# EAGLE design lp_breadboard_mini (EAGLE 7.2.0)
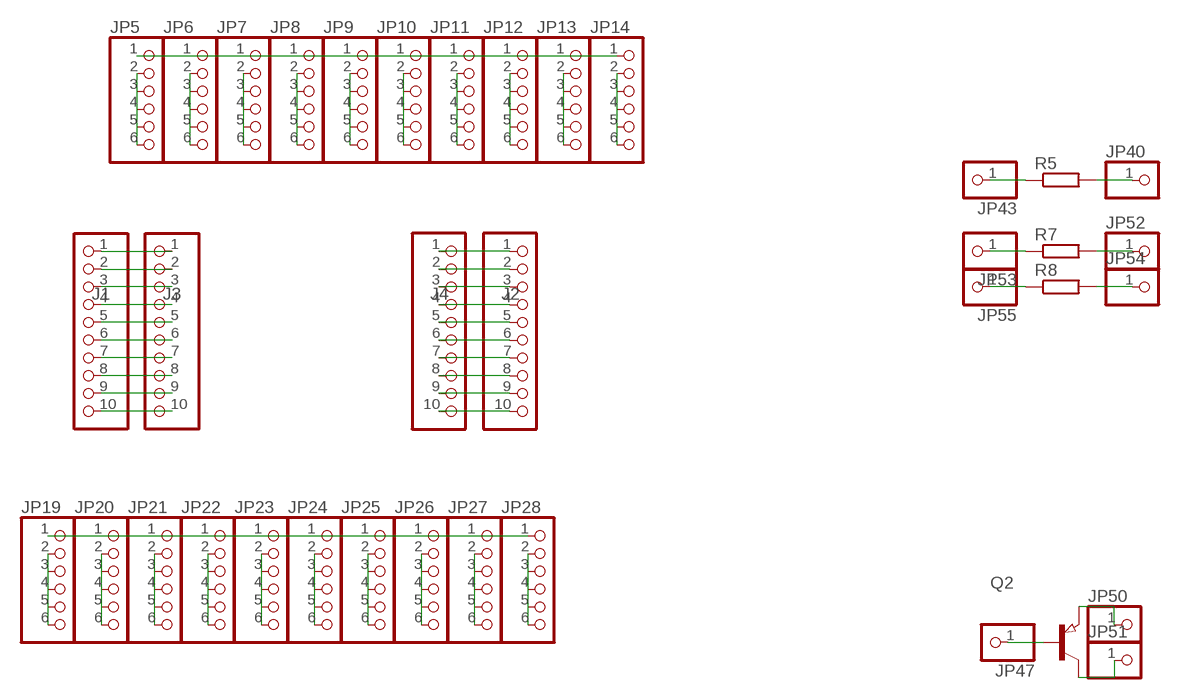
[diagram p0: schematic, sheet 1]

## Parts
J1  PINHD-1X10  [1X10]
J2  PINHD-1X10  [1X10]
J3  PINHD-1X10  [1X10]
J4  PINHD-1X10  [1X10]
JP5  PINHD-1X6  [1X06]
JP6  PINHD-1X6  [1X06]
JP7  PINHD-1X6  [1X06]
JP8  PINHD-1X6  [1X06]
JP9  PINHD-1X6  [1X06]
JP10  PINHD-1X6  [1X06]
JP11  PINHD-1X6  [1X06]
JP12  PINHD-1X6  [1X06]
JP13  PINHD-1X6  [1X06]
JP14  PINHD-1X6  [1X06]
JP19  PINHD-1X6  [1X06]
JP20  PINHD-1X6  [1X06]
JP21  PINHD-1X6  [1X06]
JP22  PINHD-1X6  [1X06]
JP23  PINHD-1X6  [1X06]
JP24  PINHD-1X6  [1X06]
JP25  PINHD-1X6  [1X06]
JP26  PINHD-1X6  [1X06]
JP27  PINHD-1X6  [1X06]
JP28  PINHD-1X6  [1X06]
JP40  PINHD-1X1  [1X01]
JP43  PINHD-1X1  [1X01]
JP47  PINHD-1X1  [1X01]
JP50  PINHD-1X1  [1X01]
JP51  PINHD-1X1  [1X01]
JP52  PINHD-1X1  [1X01]
JP53  PINHD-1X1  [1X01]
JP54  PINHD-1X1  [1X01]
JP55  PINHD-1X1  [1X01]
Q2  PNP-TRANSISTOR_SOT23  [SOT23]
R5  R-EU_R0805  [R0805]
R7  R-EU_R0805  [R0805]
R8  R-EU_R0805  [R0805]

## Nets
GND [GND]: J2.1 J4.1 JP5.1 JP6.1 JP7.1 JP8.1 JP9.1 JP10.1 JP11.1 JP12.1 JP13.1 JP14.1
N$2: J1.2 J3.2
N$3: JP6.2 JP6.3 JP6.4 JP6.5 JP6.6
N$5: JP24.2 JP24.3 JP24.4 JP24.5 JP24.6
N$10: JP19.2 JP19.3 JP19.4 JP19.5 JP19.6
N$11: JP20.2 JP20.3 JP20.4 JP20.5 JP20.6
N$12: JP7.2 JP7.3 JP7.4 JP7.5 JP7.6
N$13: JP22.2 JP22.3 JP22.4 JP22.5 JP22.6
N$14: JP21.2 JP21.3 JP21.4 JP21.5 JP21.6
N$15: J2.2 J4.2
N$16: J2.10 J4.10
N$17: JP8.2 JP8.3 JP8.4 JP8.5 JP8.6
N$18: JP9.2 JP9.3 JP9.4 JP9.5 JP9.6
N$19: JP10.2 JP10.3 JP10.4 JP10.5 JP10.6
N$21: J1.10 J3.10
N$22: JP11.2 JP11.3 JP11.4 JP11.5 JP11.6
N$24: JP23.2 JP23.3 JP23.4 JP23.5 JP23.6
N$25: J2.3 J4.3
N$26: J2.4 J4.4
N$27: J1.3 J3.3
N$28: JP12.2 JP12.3 JP12.4 JP12.5 JP12.6
N$29: JP13.2 JP13.3 JP13.4 JP13.5 JP13.6
N$30: J1.4 J3.4
N$31: J1.5 J3.5
N$32: JP14.2 JP14.3 JP14.4 JP14.5 JP14.6
N$35: J1.6 J3.6
N$36: J2.5 J4.5
N$37: J2.6 J4.6
N$39: JP5.2 JP5.3 JP5.4 JP5.5 JP5.6
N$40: J1.7 J3.7
N$41: J2.7 J4.7
N$42: JP25.2 JP25.3 JP25.4 JP25.5 JP25.6
N$43: J1.8 J3.8
N$44: J1.9 J3.9
N$45: J2.8 J4.8
N$46: JP26.2 JP26.3 JP26.4 JP26.5 JP26.6
N$47: J2.9 J4.9
N$48: JP27.2 JP27.3 JP27.4 JP27.5 JP27.6
N$49: JP28.2 JP28.3 JP28.4 JP28.5 JP28.6
N$63: JP43.1 R5.1
N$66: JP40.1 R5.2
N$70: JP47.1 Q2.1(B)
N$73: JP50.1 Q2.2(E)
N$74: JP51.1 Q2.3(C)
N$75: JP53.1 R7.1
N$76: JP52.1 R7.2
N$77: JP55.1 R8.1
N$78: JP54.1 R8.2
VCC [VCC]: J1.1 J3.1 JP19.1 JP20.1 JP21.1 JP22.1 JP23.1 JP24.1 JP25.1 JP26.1 JP27.1 JP28.1

## Library data of the parts
J1-J4 = pinhead:PINHD-1X10: PIN HEADER
JP5-JP14 JP19-JP28 = pinhead:PINHD-1X6: PIN HEADER
JP40 JP43 JP47 JP50-JP55 = pinhead:PINHD-1X1: PIN HEADER
Q2 = semicon-smd-ipc:PNP-TRANSISTOR_: PNP TRANSISTOR
R5 R7 R8 = resistor:R-EU_: RESISTOR, European symbol

## Net classes
0 default: width 0.508 mm, drill 0.508 mm
1 GND: width 0.813 mm, drill 0.508 mm
2 VCC: width 0.813 mm, drill 0.508 mm

## Board
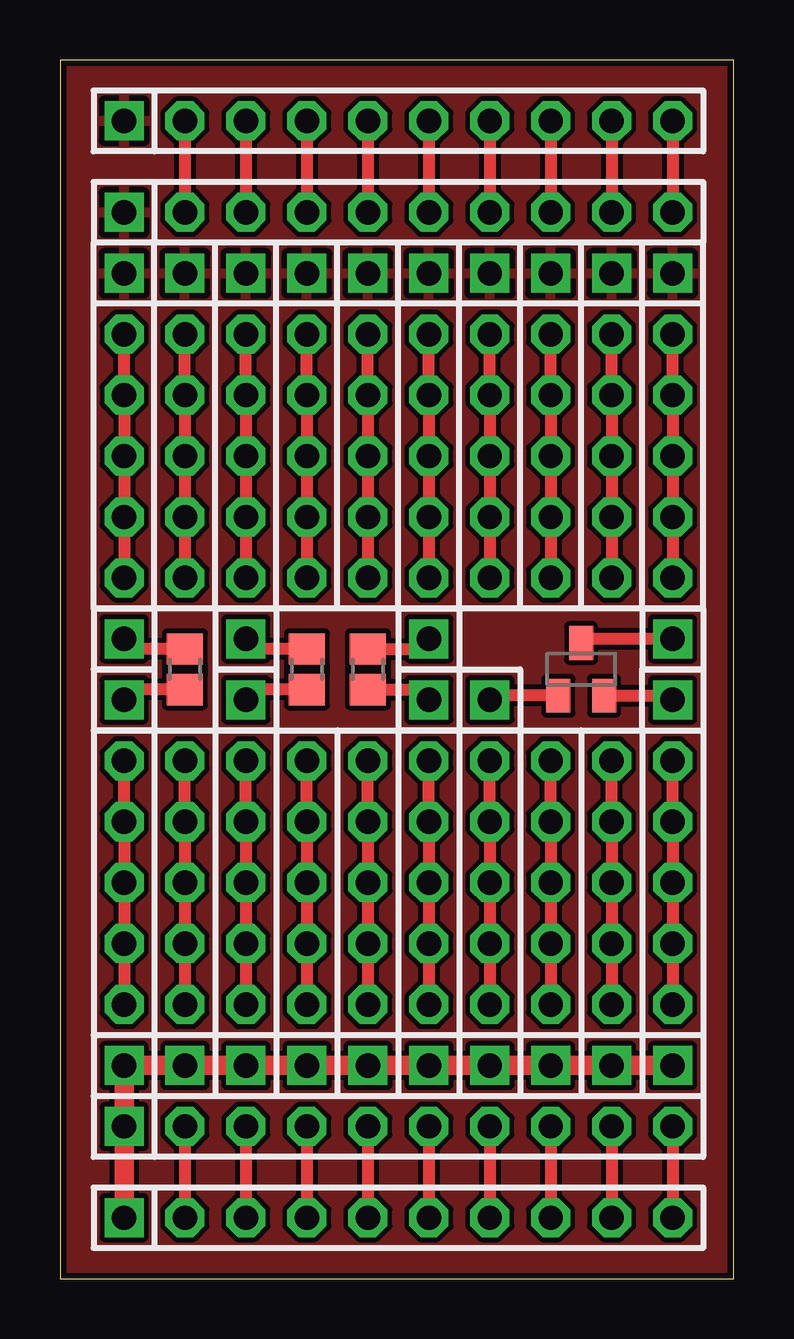
[diagram p1: board, top side]
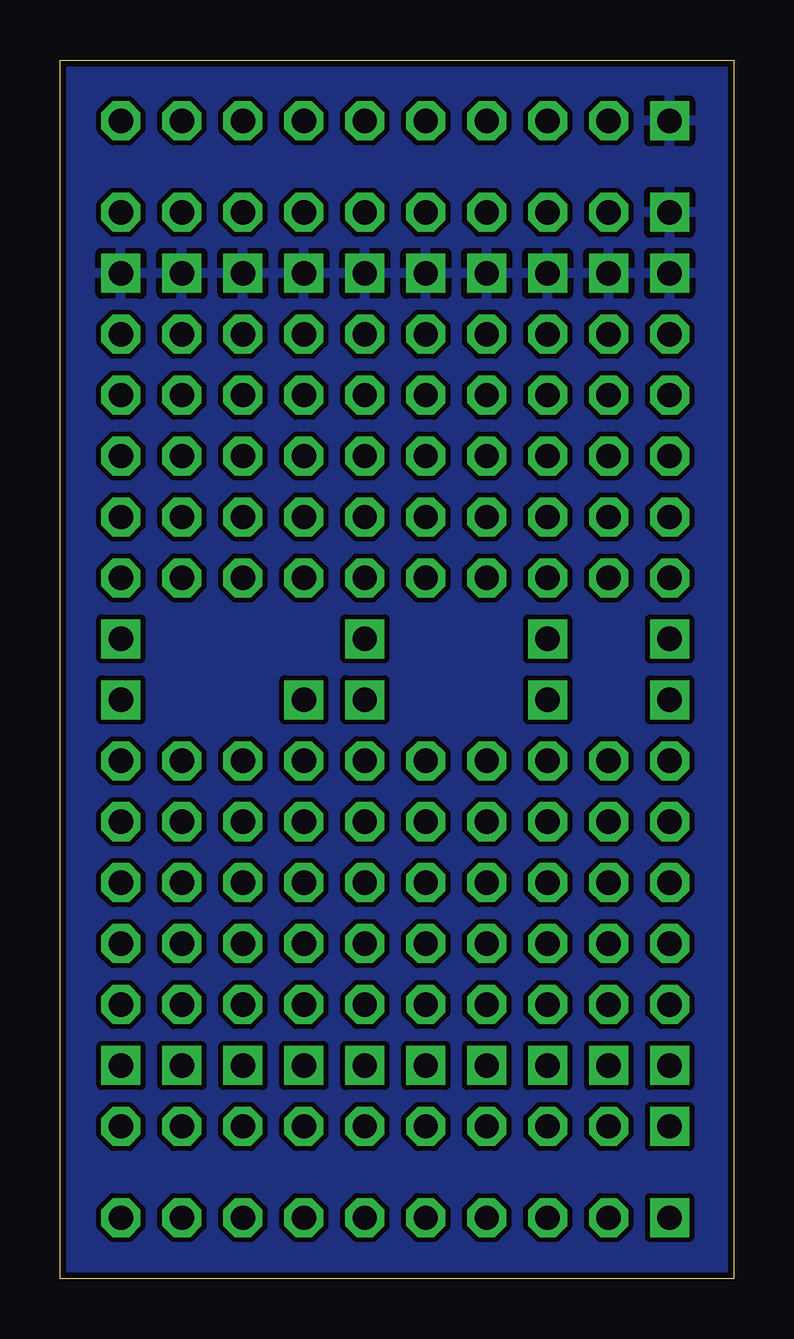
[diagram p2: board, bottom side, seen from below]

Size 28.07 x 50.8 mm. Coordinates in mm from the lower left corner, seen from the top.
Outline: 0,0 28.07,0 28.07,50.8 0,50.8 0,0
Copper layers (1*16): Top 0.035mm / dielectric 1.5mm / Bottom 0.035mm
Design rules "SparkFun *": minimum track width 20mil, minimum drill 20mil, track to track 8mil, track to pad 8mil, pad to pad 8mil, via to via 8mil, smd to smd 8mil, copper to edge 10mil, drill to drill 8mil, minimum pad ring 12mil, minimum via ring 10mil, stop-mask expansion 4mil, vias tented up to drill 25mil, thermal gap 10mil

### Footprints (pad centres in the part's own frame; a part is rotated, then mirrored left to right if it is on the bottom)
1X10 = drill 1.016 square: 1 -11.43,0 | drill 1.016 octagon: 2 -8.89,0; 3 -6.35,0; 4 -3.81,0; 5 -1.27,0; 6 1.27,0; 7 3.81,0; 8 6.35,0; 9 8.89,0; 10 11.43,0
1X06 = drill 1.016 square: 1 -6.35,0 | drill 1.016 octagon: 2 -3.81,0; 3 -1.27,0; 4 1.27,0; 5 3.81,0; 6 6.35,0
1X01 = drill 1.016 square: 1 0,0
SOT23 = smd 1 x 1.4: 1 -0.95,-1.1; 2 0.95,-1.1; 3 0,1.1
R0805 = smd 1.3 x 1.5: 1 -0.85,0; 2 0.85,0

### Placement (x,y rotation side)
J1  14.1,2.54 0 top
J2  14.1,48.26 0 top
J3  14.1,6.35 0 top
J4  14.1,44.45 0 top
JP5  2.67,35.56 270 top
JP6  5.21,35.56 270 top
JP7  7.75,35.56 270 top
JP8  10.29,35.56 270 top
JP9  12.83,35.56 270 top
JP10  15.37,35.56 270 top
JP11  17.91,35.56 270 top
JP12  20.45,35.56 270 top
JP13  22.99,35.56 270 top
JP14  25.53,35.56 270 top
JP19  25.53,15.24 90 top
JP20  22.99,15.24 90 top
JP21  20.45,15.24 90 top
JP22  17.91,15.24 90 top
JP23  15.37,15.24 90 top
JP24  12.83,15.24 90 top
JP25  10.29,15.24 90 top
JP26  7.75,15.24 90 top
JP27  5.21,15.24 90 top
JP28  2.67,15.24 90 top
JP40  2.67,26.67 0 top
JP43  2.67,24.13 0 top
JP47  17.91,24.13 0 top
JP50  25.53,24.13 90 top
JP51  25.53,26.67 0 top
JP52  7.75,26.67 0 top
JP53  7.75,24.13 0 top
JP54  15.37,26.67 0 top
JP55  15.37,24.13 0 top
Q2  21.72,25.4 0 top
R5  5.21,25.4 90 top
R7  10.29,25.4 90 top
R8  12.83,25.4 90 top

### Tracks (layer width: path | path; a pad name or v marks a point on that pad's centre or on a via)
GND
  pour Bottom: 0.13,50.8 28.07,50.8 28.07,0 0.13,0
  pour Top: 0.13,50.8 28.07,50.8 28.07,0 0.13,0
N$2
  Top 0.508: J3.2 J1.2
N$3
  Top 0.508: JP6.6 JP6.5 JP6.4 JP6.3 JP6.2
N$5
  Top 0.508: JP24.2 JP24.3 JP24.4 JP24.5 JP24.6
N$10
  Top 0.508: JP19.2 JP19.3 JP19.4 JP19.5 JP19.6
N$11
  Top 0.508: JP20.2 JP20.3 JP20.4 JP20.5 JP20.6
N$12
  Top 0.508: JP7.6 JP7.5 JP7.4 JP7.3 JP7.2
N$13
  Top 0.508: JP22.2 JP22.3 JP22.4 JP22.5 JP22.6
N$14
  Top 0.508: JP21.2 JP21.3 JP21.4 JP21.5 JP21.6
N$15
  Top 0.508: J2.2 J4.2
N$16
  Top 0.508: J2.10 J4.10
N$17
  Top 0.508: JP8.6 JP8.5 JP8.4 JP8.3 JP8.2
N$18
  Top 0.508: JP9.6 JP9.5 JP9.4 JP9.3 JP9.2
N$19
  Top 0.508: JP10.6 JP10.5 JP10.4 JP10.3 JP10.2
N$21
  Top 0.508: J3.10 J1.10
N$22
  Top 0.508: JP11.6 JP11.5 JP11.4 JP11.3 JP11.2
N$24
  Top 0.508: JP23.2 JP23.3 JP23.4 JP23.5 JP23.6
N$25
  Top 0.508: J2.3 J4.3
N$26
  Top 0.508: J2.4 J4.4
N$27
  Top 0.508: J3.3 J1.3
N$28
  Top 0.508: JP12.6 JP12.5 JP12.4 JP12.3 JP12.2
N$29
  Top 0.508: JP13.6 JP13.5 JP13.4 JP13.3 JP13.2
N$30
  Top 0.508: J3.4 J1.4
N$31
  Top 0.508: J3.5 J1.5
N$32
  Top 0.508: JP14.6 JP14.5 JP14.4 JP14.3 JP14.2
N$35
  Top 0.508: J3.6 J1.6
N$36
  Top 0.508: J2.5 J4.5
N$37
  Top 0.508: J2.6 J4.6
N$39
  Top 0.508: JP5.6 JP5.5 JP5.4 JP5.3 JP5.2
N$40
  Top 0.508: J3.7 J1.7
N$41
  Top 0.508: J2.7 J4.7
N$42
  Top 0.508: JP25.2 JP25.3 JP25.4 JP25.5 JP25.6
N$43
  Top 0.508: J3.8 J1.8
N$44
  Top 0.508: J3.9 J1.9
N$45
  Top 0.508: J2.8 J4.8
N$46
  Top 0.508: JP26.2 JP26.3 JP26.4 JP26.5 JP26.6
N$47
  Top 0.508: J2.9 J4.9
N$48
  Top 0.508: JP27.2 JP27.3 JP27.4 JP27.5 JP27.6
N$49
  Top 0.508: JP28.2 JP28.3 JP28.4 JP28.5 JP28.6
N$63
  Top 0.508: R5.1 2.67,24.55 JP43.1
N$66
  Top 0.508: R5.2 2.67,26.25 JP40.1
N$70
  Top 0.508: Q2.1 17.91,24.3 JP47.1
N$73
  Top 0.508: Q2.2 25.53,24.3 JP50.1
N$74
  Top 0.508: JP51.1 21.72,26.67 Q2.3
N$75
  Top 0.508: R7.1 7.75,24.55 JP53.1
N$76
  Top 0.508: R7.2 7.75,26.25 JP52.1
N$77
  Top 0.508: R8.1 15.37,24.55 JP55.1
N$78
  Top 0.508: R8.2 15.37,26.25 JP54.1
VCC
  Top 0.813: J1.1 J3.1 JP28.1 JP27.1 JP26.1 JP25.1 JP24.1 JP23.1 JP22.1 JP21.1 JP20.1 JP19.1